# EasyEDA Pro project esp8266.eprj

# Schematic Schematic1
Board Name: Board1; Create Date: 2025-10-31; Page Name: P1; Project Name: esp8266; Schematic Name: Schematic1; Update Date: 2025-10-31; Company: 嘉立创EDA; Page Size: A4; Version: V1.0
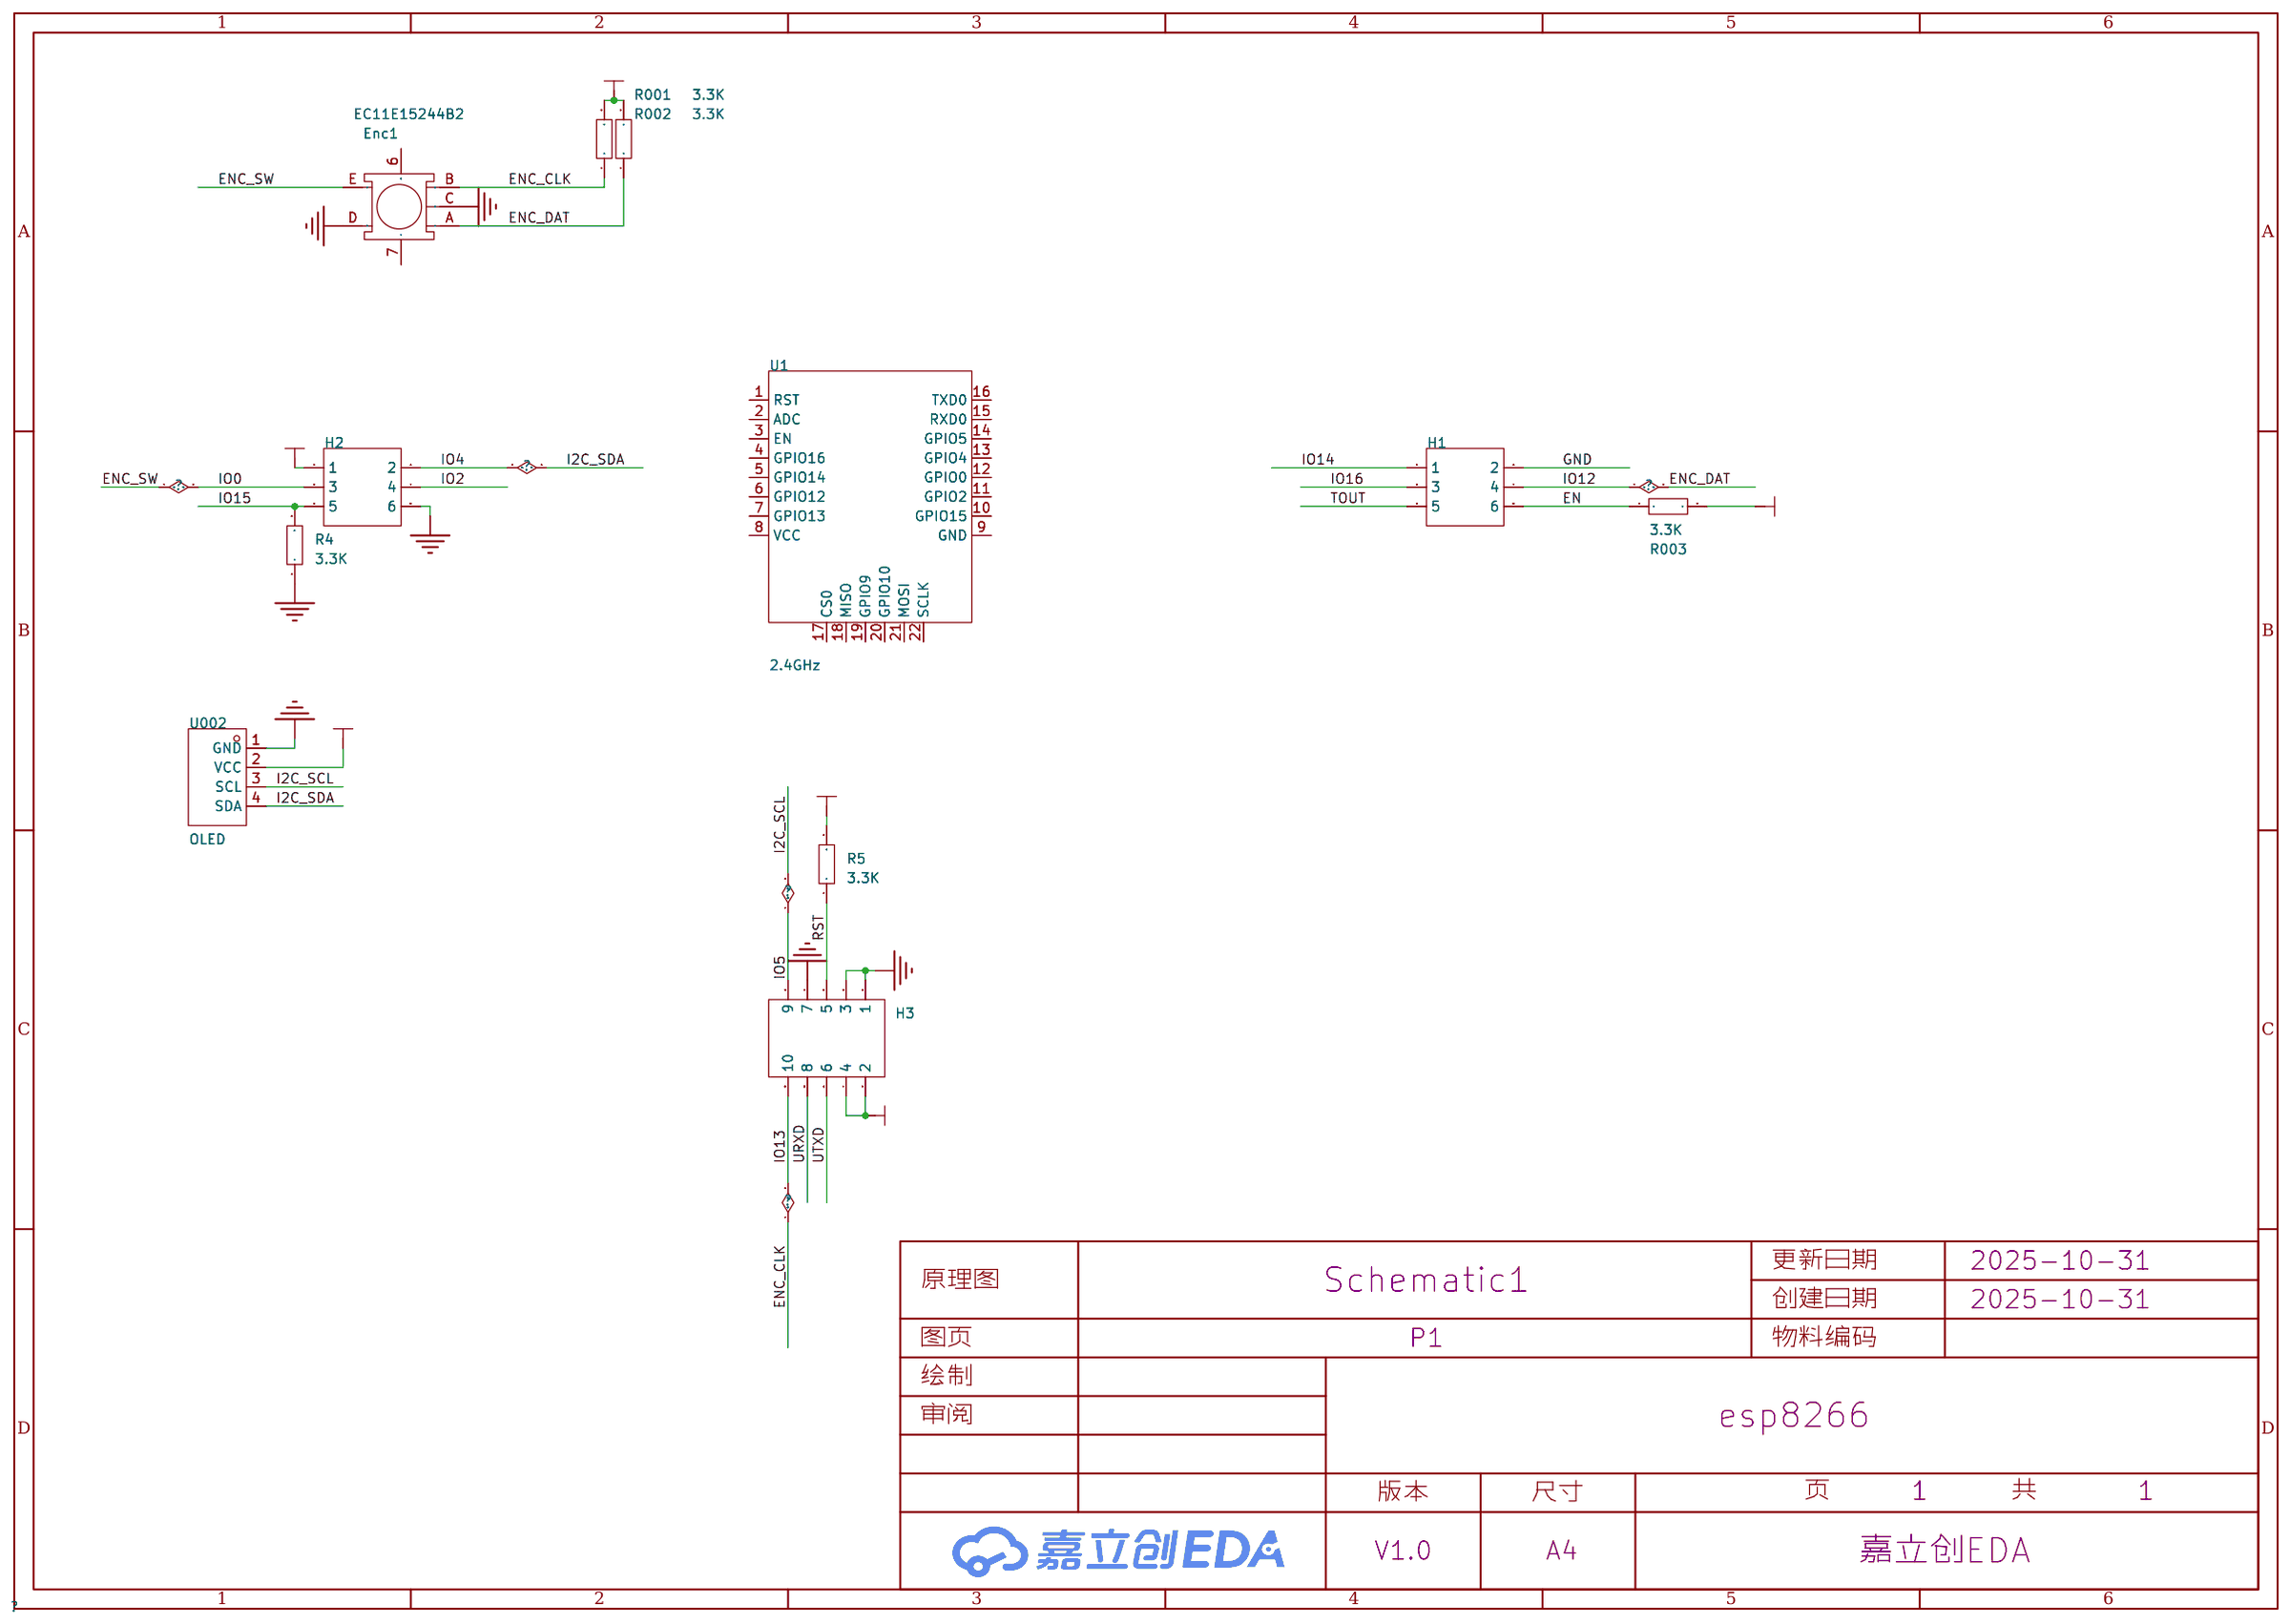
[diagram p0: schematic sheet]

## Parts
Enc1  EC11E15244B2  [SW-TH_EC11XXXXXXXX]
H1  -  [HDR-TH_6P-P2.54-V-F-R2-C3-S2.54]
H2  -  [HDR-TH_6P-P2.54-V-F-R2-C3-S2.54]
H3  -  [HDR-TH_10P-P2.54-V-F-R2-C5-S2.54]
R001  10K  [R0603]
R002  10K  [R0603]
R003  10K  [R0603]
R4  10K  [R0603]
R5  10K  [R0603]
U1  2.4GHz  [WIFIM-SMD_ESP-12F-ESP8266MOD]
U002  OLED  [OLED-TH_L27.8-W27.2-P2.54_C9900033791]

## Library data of the parts
Enc1 = EC11E15244B2_C470754: Supplier Part: C470754; Manufacturer: ALPSALPINE(阿尔卑斯阿尔派); Supplier Footprint: 插件; JLCPCB Part Class: 扩展库; Datasheet: https://atta.szlcsc.com/upload/public/pdf/source/20191216/C470795_DE763ECE59BD49533DB26DB53E5D34B2.pdf; Supplier: LCSC
H1 H2 = HDR-F_2.54_2x3: Supplier Part: C92272; Supplier Footprint: 插件
H3 = HDR-F_2.54_2x5: Supplier Part: C92270; Supplier Footprint: 插件
R001 R002 R003-R5 = Res_0603: Supplier Footprint: 0603
U1 = ESP-12F(ESP8266MOD): LCSC Part Name: 完整的802.11b/g/nWi-FiSoC模块 屏蔽罩上的丝印是：ESP8266MOD，ESP8266EX串口WIFI; Supplier Part: C82891; Manufacturer: Ai-Thinker(安信可); Supplier Footprint: SMD,16x24mm; JLCPCB Part Class: 扩展库; Datasheet: https://atta.szlcsc.com/upload/public/pdf/source/20210219/C82891_ABD84A460F4F056A2757267CCCA4B508.pdf; Supplier: LCSC; Core Processor: ESP8266芯片; Support Interface: GPIO；UART；I2C；PWM；SPI；ADC; Antenna Type: 板载PCB天线; Output Power: 16dBm; Operating Voltage: 3.3V; Receive  Current: 120mA; Send  Current: 170mA; Sensitivity: -90dBm; Operating Temperature: -40℃~+85℃
U002 = HS96L03W2C03: LCSC Part Name: 0.96寸OLED显示屏窄白光IIC; Supplier Part: C5248080; Manufacturer: HS(汉昇); JLCPCB Part Class: 扩展库; Datasheet: https://atta.szlcsc.com/upload/public/pdf/source/20230627/763D01F79A90007632F098068C7C8AD9.pdf; Supplier: LCSC; Main Control Chip: SSD1315; Interface Type: I2C; Size: 0.96; Pixel Resolution: 128x64; Operating Temperature: -40℃~+70℃

## Nets
3V3+: H2.1 H3.2 H3.4 R001.2 R002.2 R003.2 R5.2 U002.2(VCC)
GND: Enc1.C Enc1.D H1.2 H2.6 H3.1 H3.3 H3.7 R4.1 U002.1(GND)
EN: H1.6 R003.1
ENC_CLK: Enc1.B H3.10 R001.1
ENC_DAT: Enc1.A H1.4 R002.1
ENC_SW: Enc1.E H2.3
I2C_SCL: H3.9 U002.3(SCL)
I2C_SDA: H2.2 U002.4(SDA)
IO2: H2.4
IO14: H1.1
IO15: H2.5 R4.2
IO16: H1.3
RST: H3.5 R5.1
TOUT: H1.5
URXD: H3.8
UTXD: H3.6

Not connected (* = marked no-connect by the designer): Enc1 6 7; U1 1(RST) 2(ADC) 3(EN) 4(GPIO16) 5(GPIO14) 6(GPIO12) 7(GPIO13) 8(VCC) 9(GND) 10(GPIO15) 11(GPIO2) 12(GPIO0) 13(GPIO4) 14(GPIO5) 15(RXD0) 16(TXD0) 17(CS0) 18(MISO) 19(GPIO9) 20(GPIO10) 21(MOSI) 22(SCLK)
